# EAGLE design Pow-OR v13-SFE (EAGLE 6.5.0)
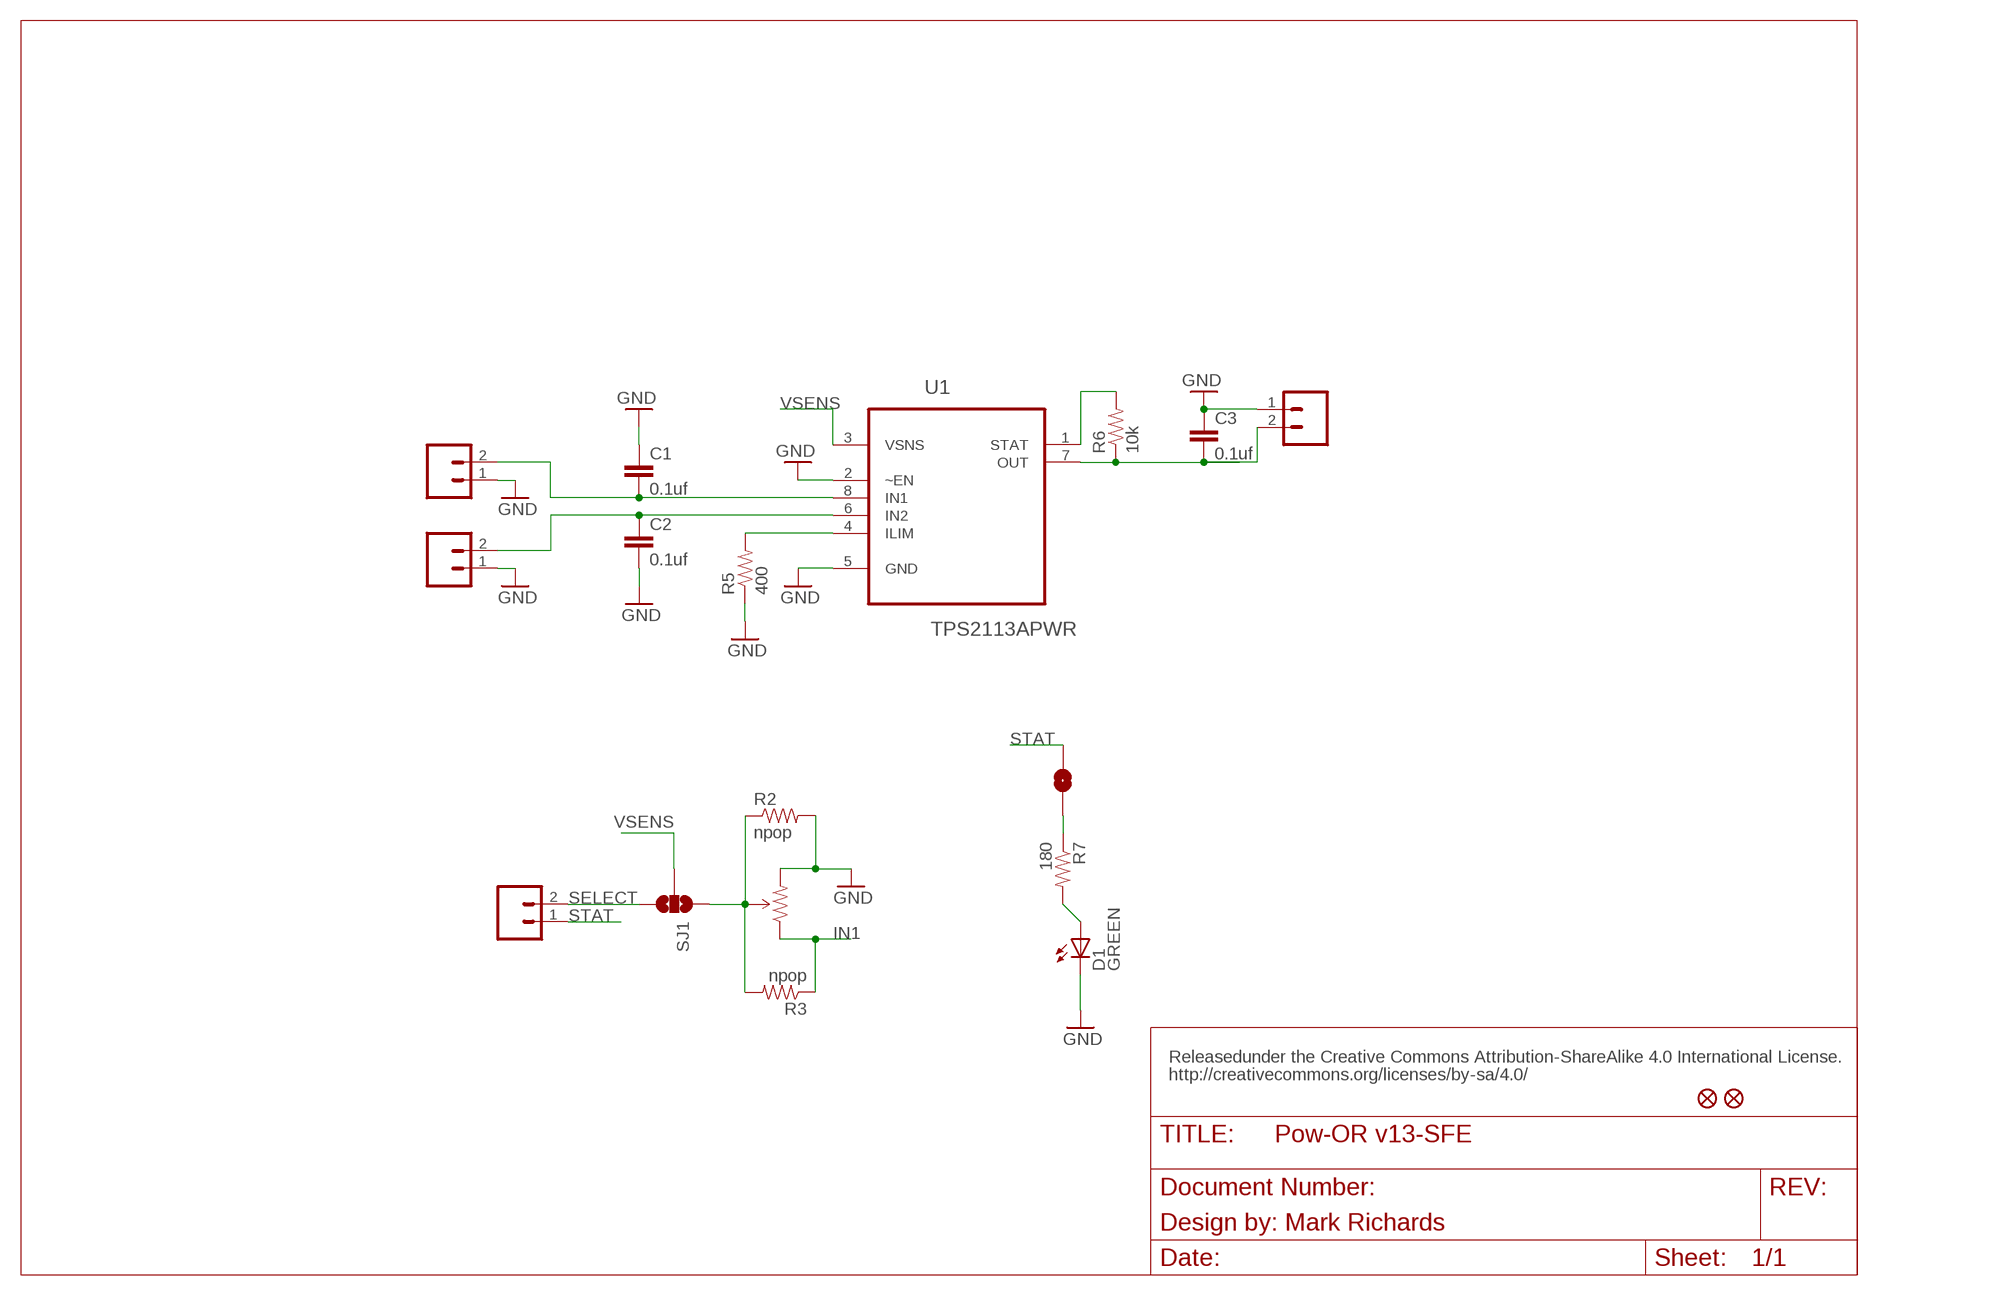
[diagram p0: schematic, sheet 1]

## Parts
C1  0.1uf  CAP0603-CAP  [0603-CAP]
C2  0.1uf  CAP0603-CAP  [0603-CAP]
C3  0.1uf  CAP0603-CAP  [0603-CAP]
D1  GREEN  LED-GREEN0603  [LED-0603]
FID1  FIDUCIAL1X2  [FIDUCIAL-1X2]
FID2  FIDUCIAL1X2  [FIDUCIAL-1X2]
JP3  M021X02_NO_SILK  [1X02_NO_SILK]
JP4  M021X02_NO_SILK  [1X02_NO_SILK]
JP5  M021X02_NO_SILK  [1X02_NO_SILK]
JP6  M021X02_NO_SILK  [1X02_NO_SILK]
R1  TRIMPOT-PTH-KNOB  [3386U]
R2  npop  RESISTOR0603  [0603-RES]
R3  npop  RESISTOR0603  [0603-RES]
R5  400  RESISTOR0603-RES  [0603-RES]
R6  10k  RESISTOR0603-RES  [0603-RES]
R7  180  RESISTOR0603-RES  [0603-RES]
SJ1  SOLDERJUMPER_2WAYPASTE1&2  [SJ_3_PASTE1&2]
SJ2  SOLDERJUMPERNC2  [SJ_2S-NOTRACE]
U1  TPS2113APWR  [SOP65P640X120-8N]

## Nets
GND: C1.1 C2.2 C3.1 D1.C JP3.1 JP4.1 JP6.1 R1.3(CW) R2.2 R5.1 U1.2(~EN) U1.5(GND)
ILIM: R5.2 U1.4(ILIM)
IN1: C1.2 JP3.2 R1.1(CCW) R3.1 U1.8(IN1)
IN2: C2.1 JP4.2 U1.6(IN2)
N$1: D1.A R7.2
N$2: R1.2(WIPER) R2.1 R3.2 SJ1.1
N$3: R7.1 SJ2.1
OUT: C3.2 JP6.2 R6.1 U1.7(OUT)
SELECT: JP5.2 SJ1.3
STAT: JP5.1 R6.2 SJ2.2 U1.1(STAT)
VSENS: SJ1.2 U1.3(VSNS)

## Notes on the sheet
- Releasedunder the Creative Commons Attribution-ShareAlike 4.0 International License.
- http://creativecommons.org/licenses/by-sa/4.0/
- Design by: Mark Richards

## Library data of the parts
C1 C2 = SparkFun-Passives:CAP: Capacitor Standard 0603 ceramic capacitor, and 0.1" leaded capacitor.
C3 = SparkFun-Capacitors:CAP: Capacitor Standard 0603 ceramic capacitor, and 0.1" leaded capacitor.
D1 = SparkFun-LED:LED-GREEN: Various green LEDs 0603- DIO-00821 LARGE- DIO-00862 LILYPAD- DIO-09910; PROD_ID: DIO-00821
FID1 FID2 = SparkFun-Aesthetics:FIDUCIAL: Fiducial Alignment Points Various fiducial points for machine vision alignment.
JP3-JP6 = SparkFun-Connectors:M02: Standard 2-pin 0.1" header. Use with - straight break away headers ( PRT-00116) - right angle break away headers (PRT-00553) - swiss pins (PRT-00743) - machine pins (PRT-00117) - female headers (PRT-00115) Molex polarized connector foot print use with: PRT-08233 with associated crimp pins and housings. 2.54_SCREWTERM for use with PRT-10571. 3.5mm Screw Terminal footprints for PRT-08084 5mm Screw Terminal footprints for use with PRT-08433
R1 = SparkFun-Electromechanical:TRIMPOT: Various small potentiometers for "set-and-forget" applications
R2 R3 = SparkFun-Resistors:RESISTOR: Resistor Basic schematic elements and footprints for 0603, 1206, and PTH resistors.
R5-R7 = SparkFun-Passives:RESISTOR: Resistor Basic schematic elements and footprints for 0603, 1206, and PTH resistors.
SJ1 = SparkFun-Passives:SOLDERJUMPER_2WAY: Solder Jumper 2 way solder jumper
SJ2 = SparkFun-Passives:SOLDERJUMPER: Solder Jumper Standard SMD solder jumper. Used to automate production. Two varients : Normally Open and Normally Closed are the same, but have different paste layers. NC will have a large amount of paste and should jumper during reflow.
U1 = Texas Instruments_By_element14_Batch_1:TPS2113APWR: AUTOSWITCHING POWER MUX; MPN: TPS2113APWR; OC_FARNELL: 1757288; OC_NEWARK: 01J0961; PACKAGE: TSSOP-8; SUPPLIER: TEXAS INSTRUMENTS

## Board
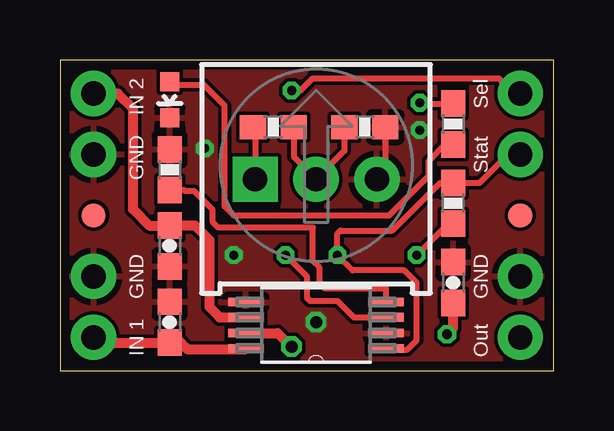
[diagram p1: board, top side]
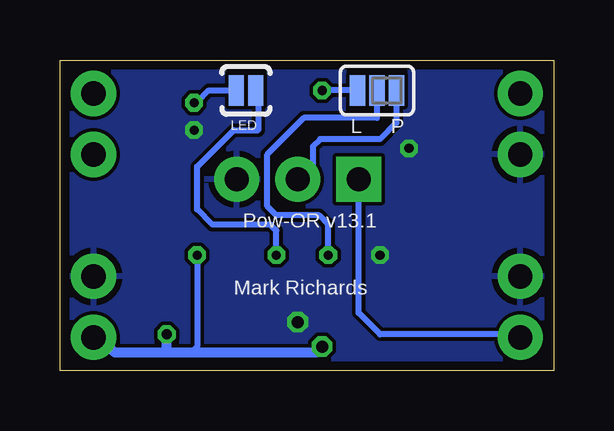
[diagram p2: board, bottom side, seen from below]

Size 20.57 x 12.95 mm. Coordinates in mm from the lower left corner, seen from the top.
Outline: 0,0 20.57,0 20.57,12.95 0,12.95 0,0
Copper layers (1*16): Top 0.0356mm / dielectric 1.5011mm / Bottom 0.0356mm
Design rules "LaenPCBOrder": minimum track width 6mil, minimum drill 13mil, track to track 6mil, track to pad 6mil, pad to pad 6mil, via to via 6mil, smd to smd 6mil, copper to edge 15mil, drill to drill 6mil, minimum pad ring 7mil, minimum via ring 7mil, stop-mask expansion 3mil, vias tented up to drill 0mil, thermal gap 10mil

### Footprints (pad centres in the part's own frame; a part is rotated, then mirrored left to right if it is on the bottom)
0603-CAP = smd 1.1 x 1: 1 -0.85,0; 2 0.85,0
LED-0603 = smd 0.8 x 0.8: A 0,-0.75; C 0,0.75
FIDUCIAL-1X2 = smd 1 x 1: 1 0,0
1X02_NO_SILK = drill 1.016 pad 1.88: 1 0,0; 2 2.54,0
3386U = drill 1.016 pad 1.88 square: 1 -2.54,-0.015 | drill 1.016 pad 1.88: 2 0,-0.015; 3 2.54,-0.015
0603-RES = smd 1.1 x 1: 1 -0.85,0; 2 0.85,0
SJ_3_PASTE1&2 = smd 0.635 x 1.27: 1 -0.813,0; 2 0,0; 3 0.813,0
SJ_2S-NOTRACE = smd 0.635 x 1.27: 1 -0.401,0; 2 0.413,0
SOP65P640X120-8N = smd 1.473 x 0.356: 1 -2.921,0.965; 2 -2.921,0.33; 3 -2.921,-0.33; 4 -2.921,-0.965; 5 2.921,-0.965; 6 2.921,-0.33; 7 2.921,0.33; 8 2.921,0.965

### Placement (x,y rotation side)
C1  4.57,2.03 270 top
C2  4.57,5.21 270 top
C3  16.38,3.68 270 top
D1  4.57,11.3 180 top
FID1  1.4,6.48 0 top
FID2  19.18,6.48 0 top
JP3  1.4,3.94 270 top
JP4  1.4,9.02 90 top
JP5  19.18,9.02 90 top
JP6  19.18,3.94 270 top
R1  10.67,8 0 top
R2  12.7,10.16 0 top
R3  8.89,10.16 0 top
R5  4.57,8.38 270 top
R6  16.38,6.98 90 top
R7  16.38,10.29 270 top
SJ1  7.37,11.68 180 bottom
SJ2  12.83,11.68 0 bottom
U1  10.67,1.91 180 top

### Tracks (layer width: path | path; a pad name or v marks a point on that pad's centre or on a via)
GND  (via drill 0.38, 0.5)
  Top 0.254: R2.2 13.55,8.33 R1.3
  other vias: 7.24,4.83 10.67,2.03 6.03,9.27 14.99,10.03
  pour Bottom: 0,12.95 20.57,12.95 20.57,0 0,0
  pour Top: 0,12.95 20.57,12.95 20.57,0 0,0
ILIM
  Top 0.254: U1.4 13.59,3.43 11.05,3.43 10.79,3.68 10.79,4.32 10.54,4.57 10.54,5.97 6.6,5.97 6.35,6.22 6.35,6.73 5.59,7.49 5.21,7.49 5.17,7.53 R5.2
IN1
  Top 0.254: R3.1 8.13,10.16 R1.1
  Top 0.406: 4.79,1.18 C1.2 | JP3.2 1.61,1.18 C1.2 | U1.8 7.7,0.89 5.33,0.89 5.04,1.18 C1.2
  Bottom 0.254: R1.1 8.13,2.41 7.24,1.52 1.52,1.52 JP3.2
IN2
  Top 0.406: U1.6 6.65,2.24 6.22,2.67 6.22,5.46 5.63,6.06 C2.1 3.72,6.06 3.05,6.73 3.05,10.92 2.41,11.56 JP4.2
N$1
  Top 0.254: R7.2 16.04,9.44 15.37,8.76 15.37,8.13 13.72,6.48 7.24,6.48 6.86,6.86 6.86,11.05 5.98,11.93 4.7,11.93 D1.A
N$2
  Top 0.254: R3.2 9.74,8.91 R1.2 11.85,9.17 R2.1
  Bottom 0.254: SJ1.1 6.55,10.34 7.24,9.65 9.74,9.65 10.03,9.36 10.03,8.62 R1.2
N$3  (via drill 0.38)
  Top 0.254: v14.99,11.18 15.03,11.14 R7.1
  Bottom 0.254: SJ2.1 14.37,11.68 14.88,11.18 v14.99,11.18
OUT  (via drill 0.38, 0.41, 0.5)
  Top 0.254: v14.86,4.83 16.17,6.13 R6.1
  Top 0.406: U1.7 9.07,1.57 9.63,1.02 v9.65,1.02 | v16.13,1.52 16.38,1.78 C3.2
  Bottom 0.254: 16.26,0.89 16.38,0.76 | v14.86,4.83 14.86,1.02 15.11,0.76
  Bottom 0.406: 16.13,0.76 15.11,0.76 9.91,0.76 v9.65,1.02 | 16.13,0.76 16.38,0.76 18.29,0.76 18.92,1.4 JP6.2 | 16.13,0.76 v16.13,1.52
SELECT  (via drill 0.38)
  Top 0.254: JP5.2 18.92,11.56 18.29,12.19 10.54,12.19 10.03,11.68 v9.65,11.68
  Bottom 0.254: SJ1.3 v9.65,11.68
STAT  (via drill 0.38)
  Top 0.254: U1.1 13.64,0.89 14.48,0.89 14.86,1.27 14.86,3.68 14.35,4.19 12.19,4.19 v11.56,4.83 11.56,5.71 11.68,5.84 13.84,5.84 15.84,7.83 R6.2 17.49,7.83 18.67,9.02 JP5.1
  Bottom 0.254: v11.56,4.83 11.56,5.84 11.81,6.1 14.22,6.1 14.86,6.73 14.86,8.51 13.34,10.03 12.32,10.03 12.32,11.59 SJ2.2
VSENS  (via drill 0.38)
  Top 0.254: v9.4,4.83 10.29,3.94 10.29,3.05 10.41,2.92 11.56,2.92 12.24,2.24 U1.3
  Bottom 0.254: SJ1.2 7.37,10.54 10.41,10.54 11.94,9.02 11.94,6.86 11.56,6.48 9.78,6.48 9.4,6.1 v9.4,4.83

### Text on the board
tPlace: IN 2 | Sel | GND | Stat | GND | GND | IN 1 | Out
bPlace: P | L | LED | Pow-OR v13.1 | Mark Richards